# Altium schematic sheet Sheet1.SchDoc
size A0; SheetNumber: 3; SheetTotal: 4
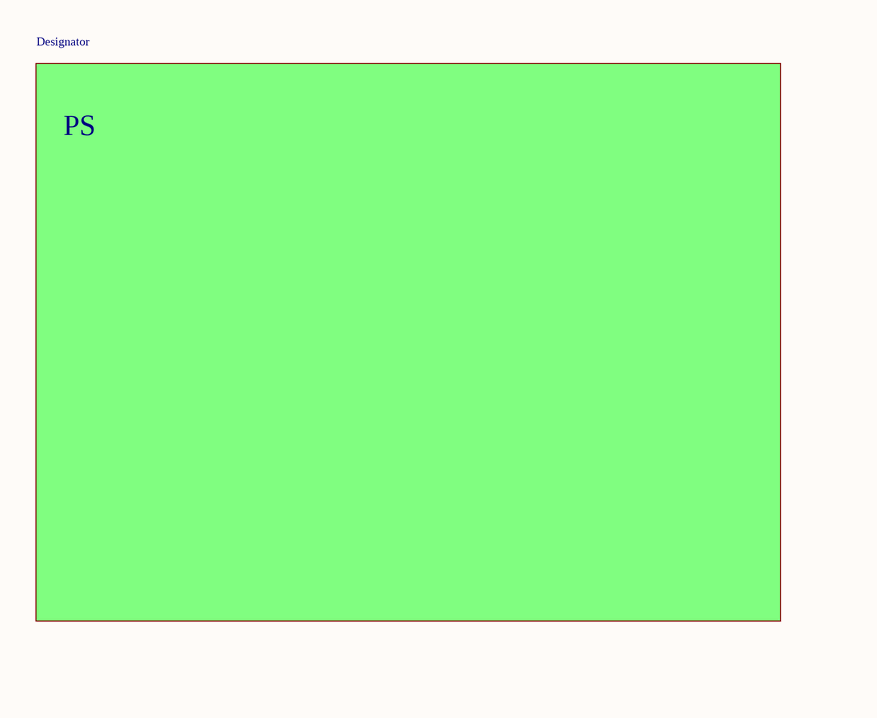
[diagram p0: Sheet1.SchDoc, left]
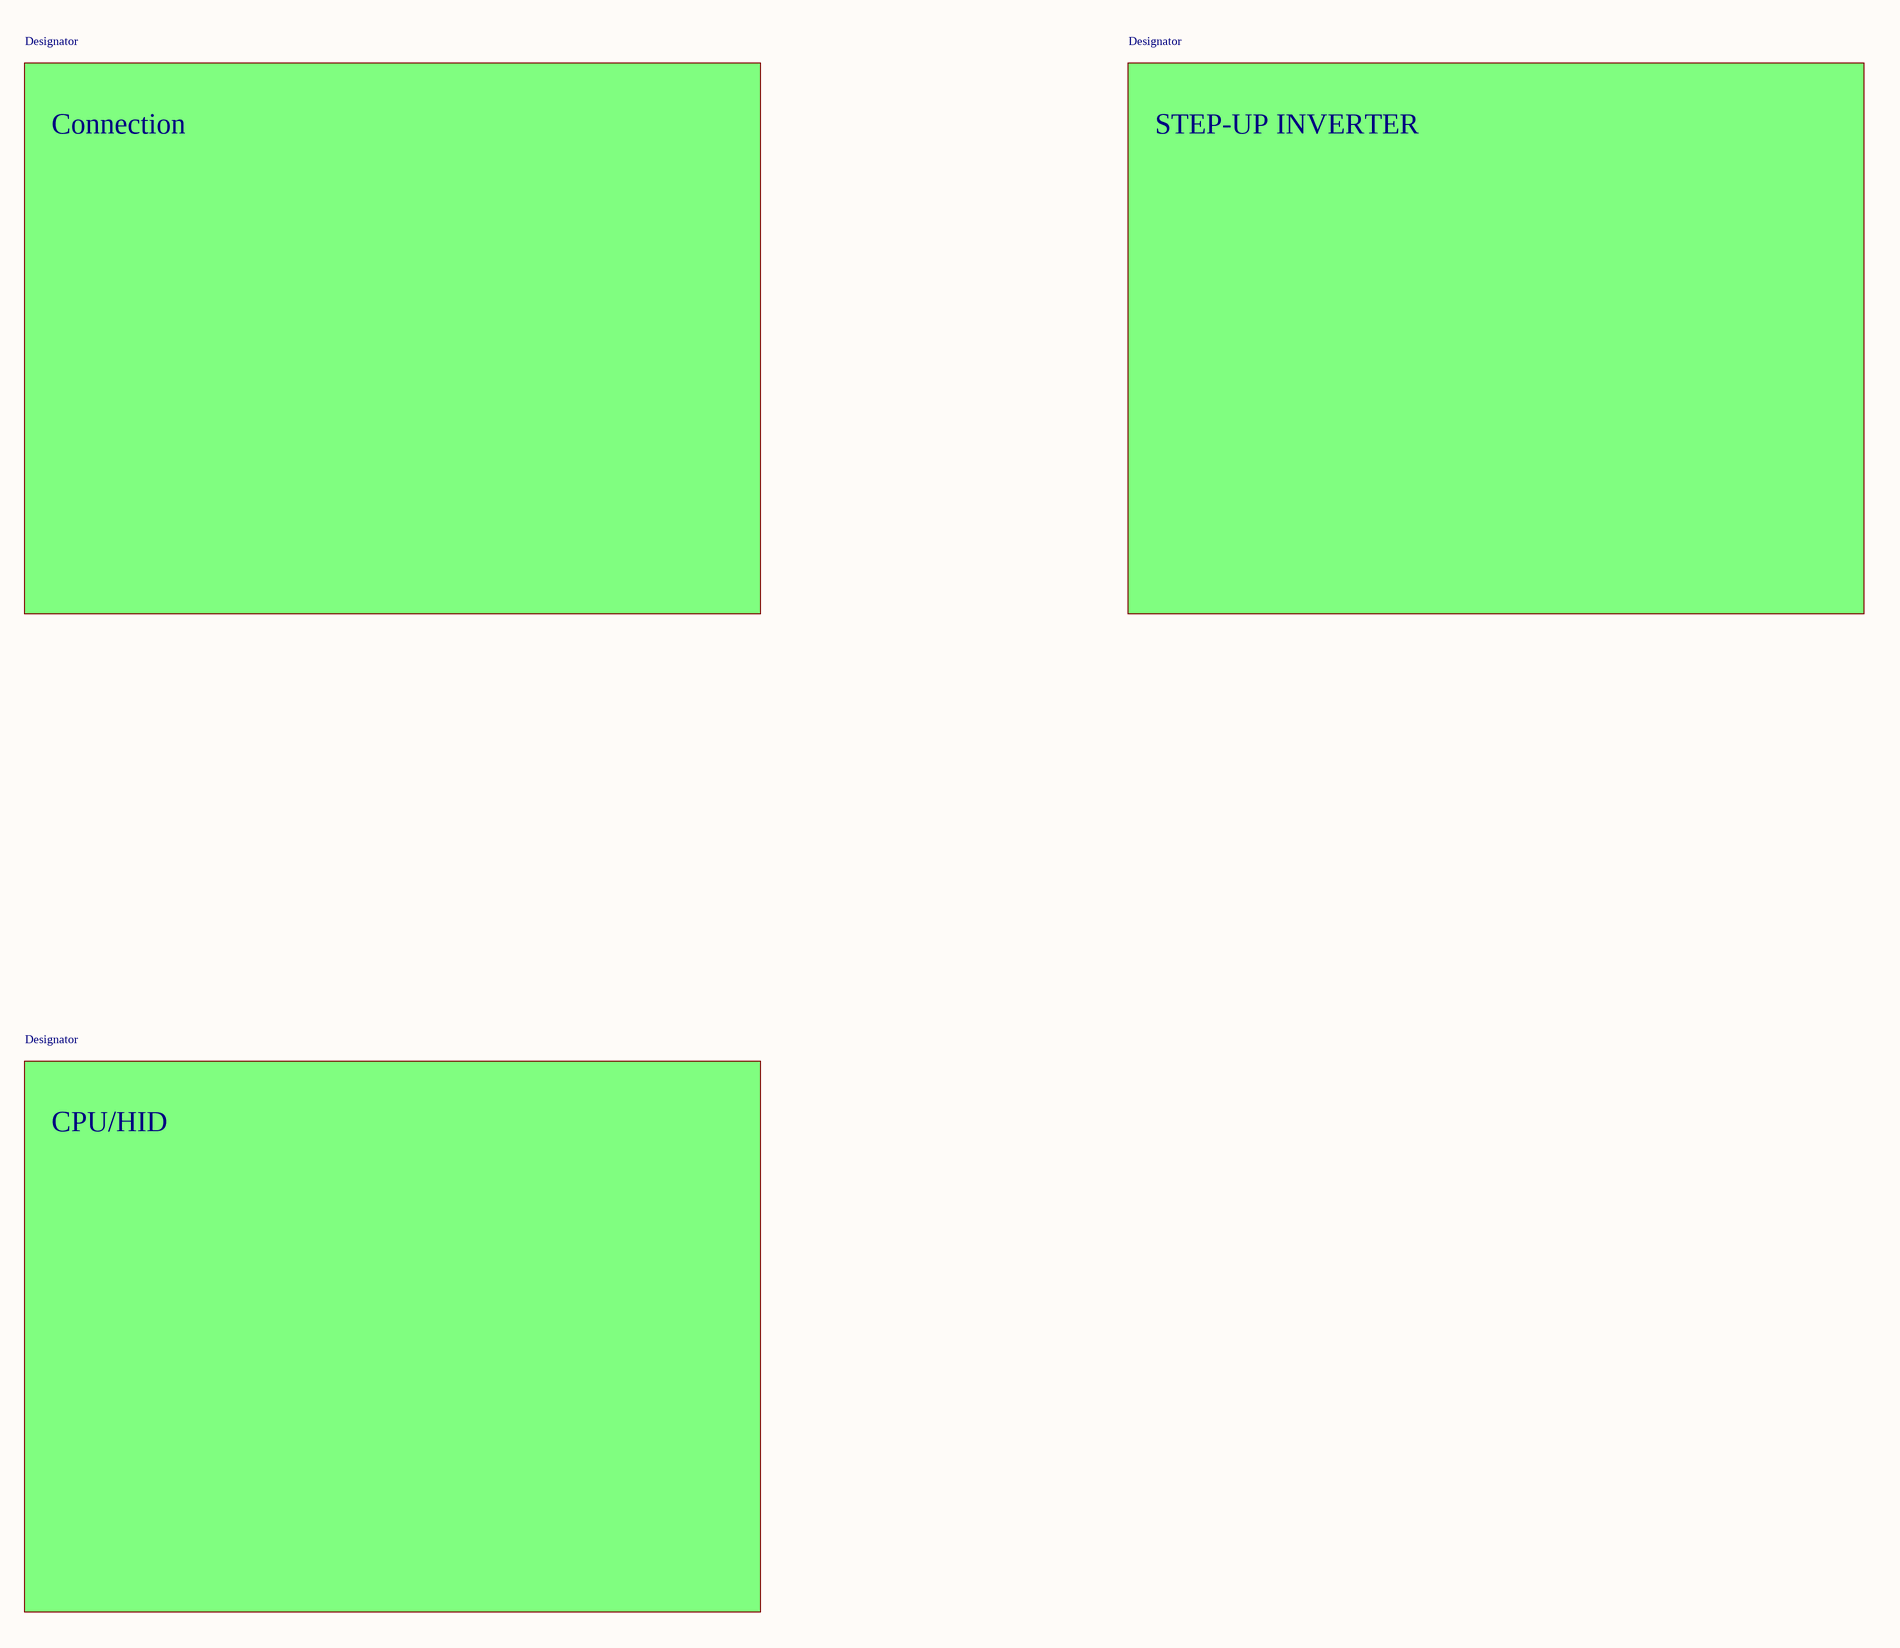
[diagram p1: Sheet1.SchDoc, right]

## Sub-sheets
Designator = PS: no entries
Designator = Connection: no entries
Designator = STEP-UP INVERTER: no entries
Designator = CPU/HID: no entries